# EAGLE design A1391-v10 (EAGLE 6.2)
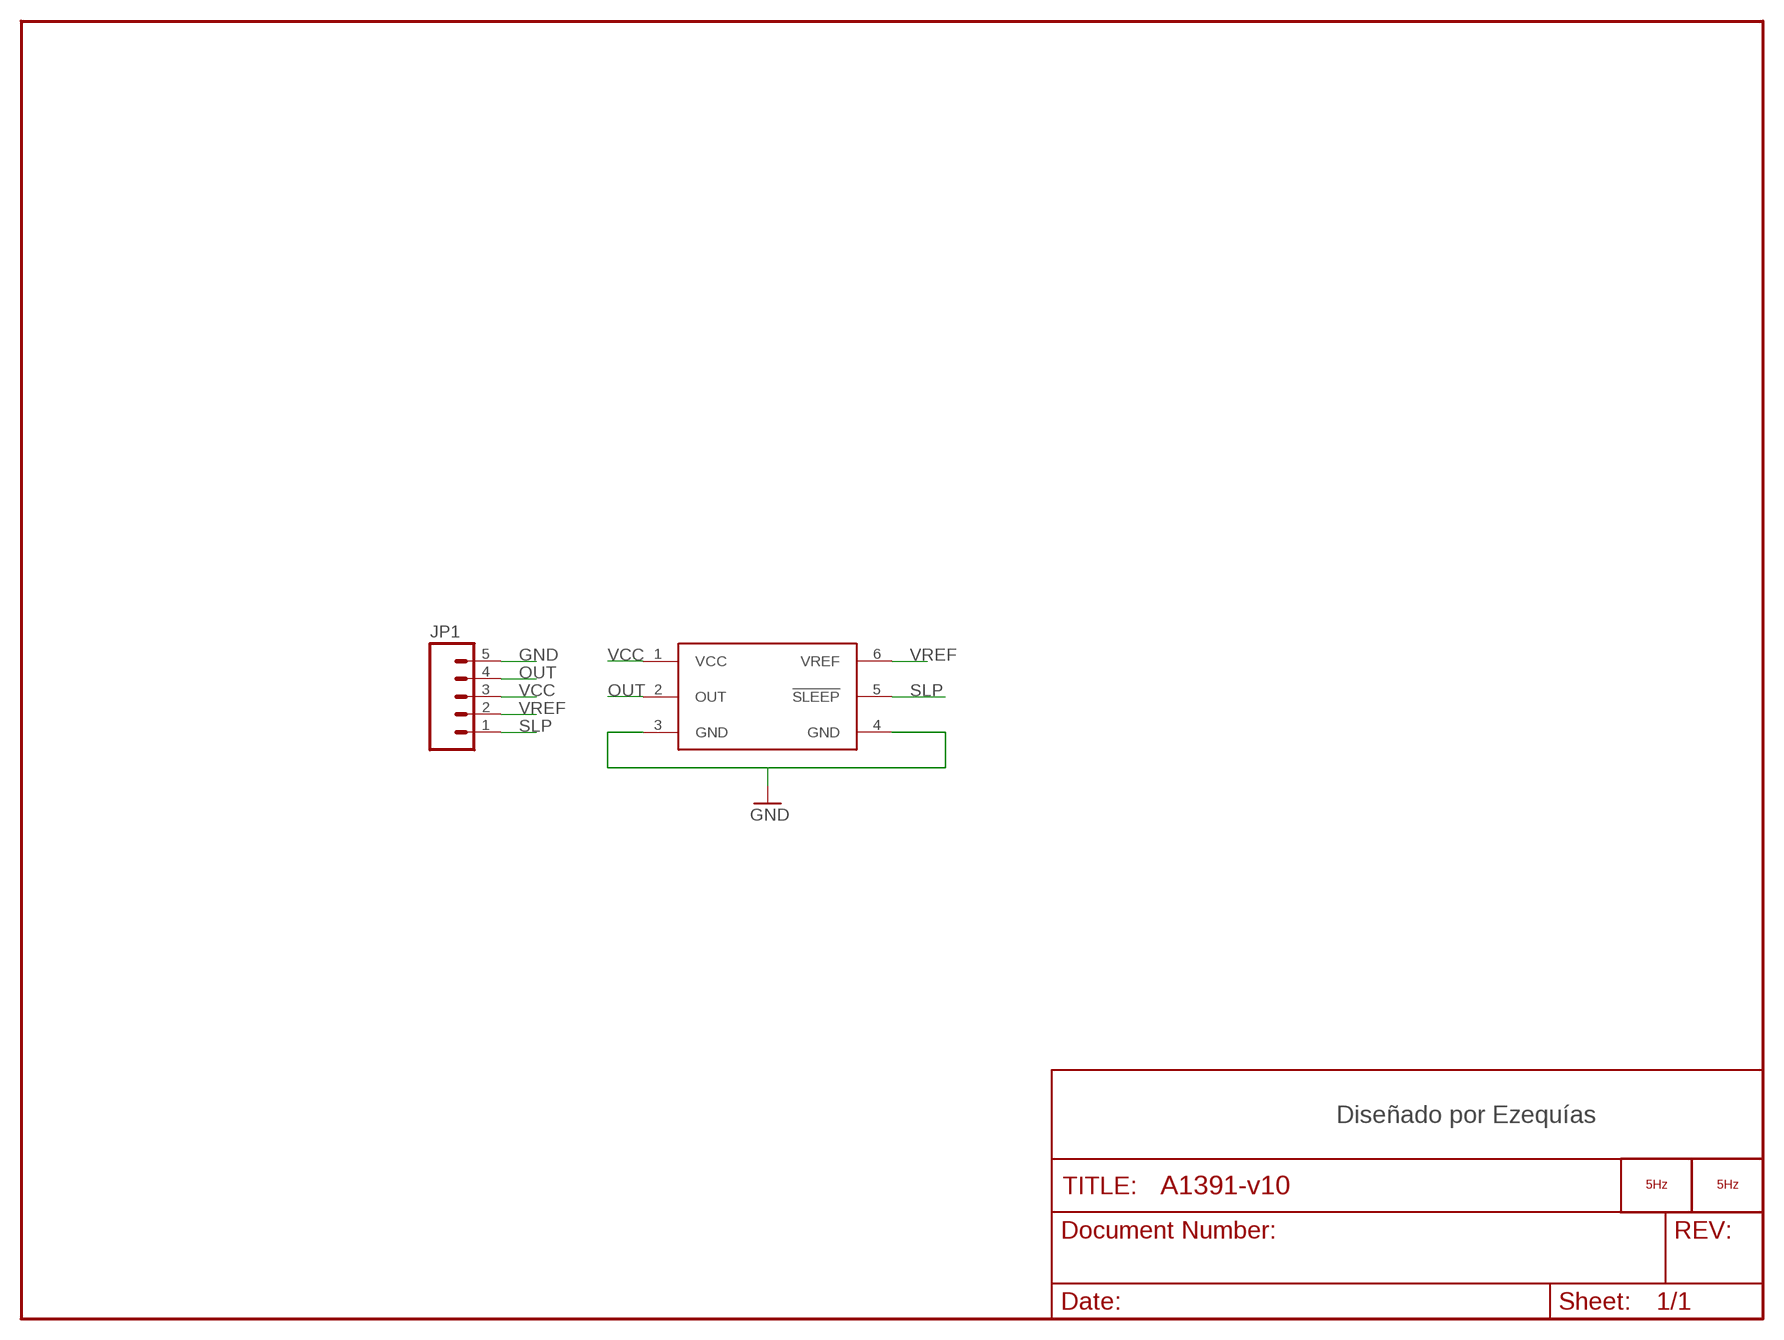
[diagram p0: schematic, sheet 1]

## Parts
JP1  M05PTH  [1X05]
LOGO1  LOGO_5HZ_CIRC_4MM  [5HZ_LOGO_CIRC_4MM]
LOGO2  LOGO_5HZ_MAIN_10MM  [5HZ_LOGO_MAIN_10MM]
U$1  A1391DFN  [DFN-6]

## Nets
GND: JP1.5 U$1.3(GND) U$1.4(GND)
OUT: JP1.4 U$1.2(OUT)
SLP: JP1.1 U$1.5(!SLEEP)
VCC: JP1.3 U$1.1(VCC)
VREF: JP1.2 U$1.6(VREF)

## Notes on the sheet
- Diseñado por Ezequías

## Library data of the parts
JP1 = SparkFun:M05: Header 5 Standard 5-pin 0.1" header. Use with straight break away headers (SKU : PRT-00116), right angle break away headers (PRT-00553), swiss pins (PRT-00743), machine pins (PRT-00117), and female headers (PRT-00115). Molex polarized connector foot print use with SKU : PRT-08230 with associated crimp pins and housings.
LOGO1 LOGO2 = 5hz-electronica:LOGO_5HZ: Logotipo 5Hz "según Pedro"
U$1 = PEDRO:A1391

## Board
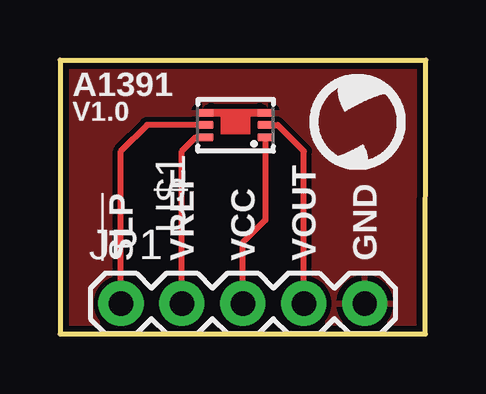
[diagram p1: board, top side]
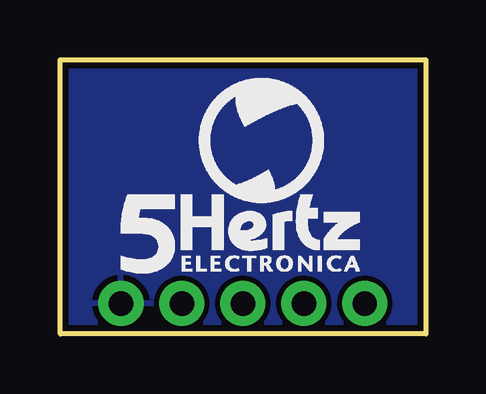
[diagram p2: board, bottom side, seen from below]

Size 15.24 x 11.43 mm. Coordinates in mm from the lower left corner, seen from the top.
Outline: 0,0 15.22,0 15.24,11.43 0,11.43 0,0
Copper layers (1*16): Top 0.035mm / dielectric 1.5mm / Bottom 0.035mm
Design rules: minimum track width 8mil, minimum drill 20mil, track to track 8mil, track to pad 8mil, pad to pad 8mil, via to via 8mil, smd to smd 8mil, copper to edge 10mil, drill to drill 8mil, minimum pad ring 12mil, minimum via ring 10mil, stop-mask expansion 4mil, vias tented up to drill 25mil, thermal gap 10mil

### Footprints (pad centres in the part's own frame; a part is rotated, then mirrored left to right if it is on the bottom)
1X05 = drill 1.016 pad 1.88: 1 0,0; 2 2.54,0; 3 5.08,0; 4 7.62,0; 5 10.16,0
DFN-6 = smd 0.305 x 0.66: 1 0.584,0.33; 2 1.092,0.33; 3 1.6,0.33; 4 1.6,2.819; 5 1.092,2.819; 6 0.584,2.819

### Placement (x,y rotation side)
JP1  2.54,1.27 0 top
LOGO1  10.41,6.86 0 top
LOGO2  12.7,2.54 0 bottom
U$1  8.89,7.62 90 top

### Tracks (layer width: path | path; a pad name or v marks a point on that pad's centre or on a via)
GND
  pour Top: 0,11.43 0,0 15.24,0 15.24,11.43
  pour Bottom: 0,11.43 15.24,11.43 15.24,0 0,0
OUT
  Top 0.254: JP1.4 10.16,7.62 9.07,8.71 U$1.2
SLP
  Top 0.254: JP1.1 2.54,7.62 3.63,8.71 U$1.5
VCC
  Top 0.254: JP1.3 7.62,3.81 8.56,4.75 U$1.1
VREF
  Top 0.254: JP1.2 5.08,7.62 5.66,8.2 U$1.6

### Text on the board
tPlace: A1391 | V1.0 | !SLP | VREF | VCC | VOUT | GND